# Altium schematic sheet DK_GU906_HW_V1.SchDoc
size A4
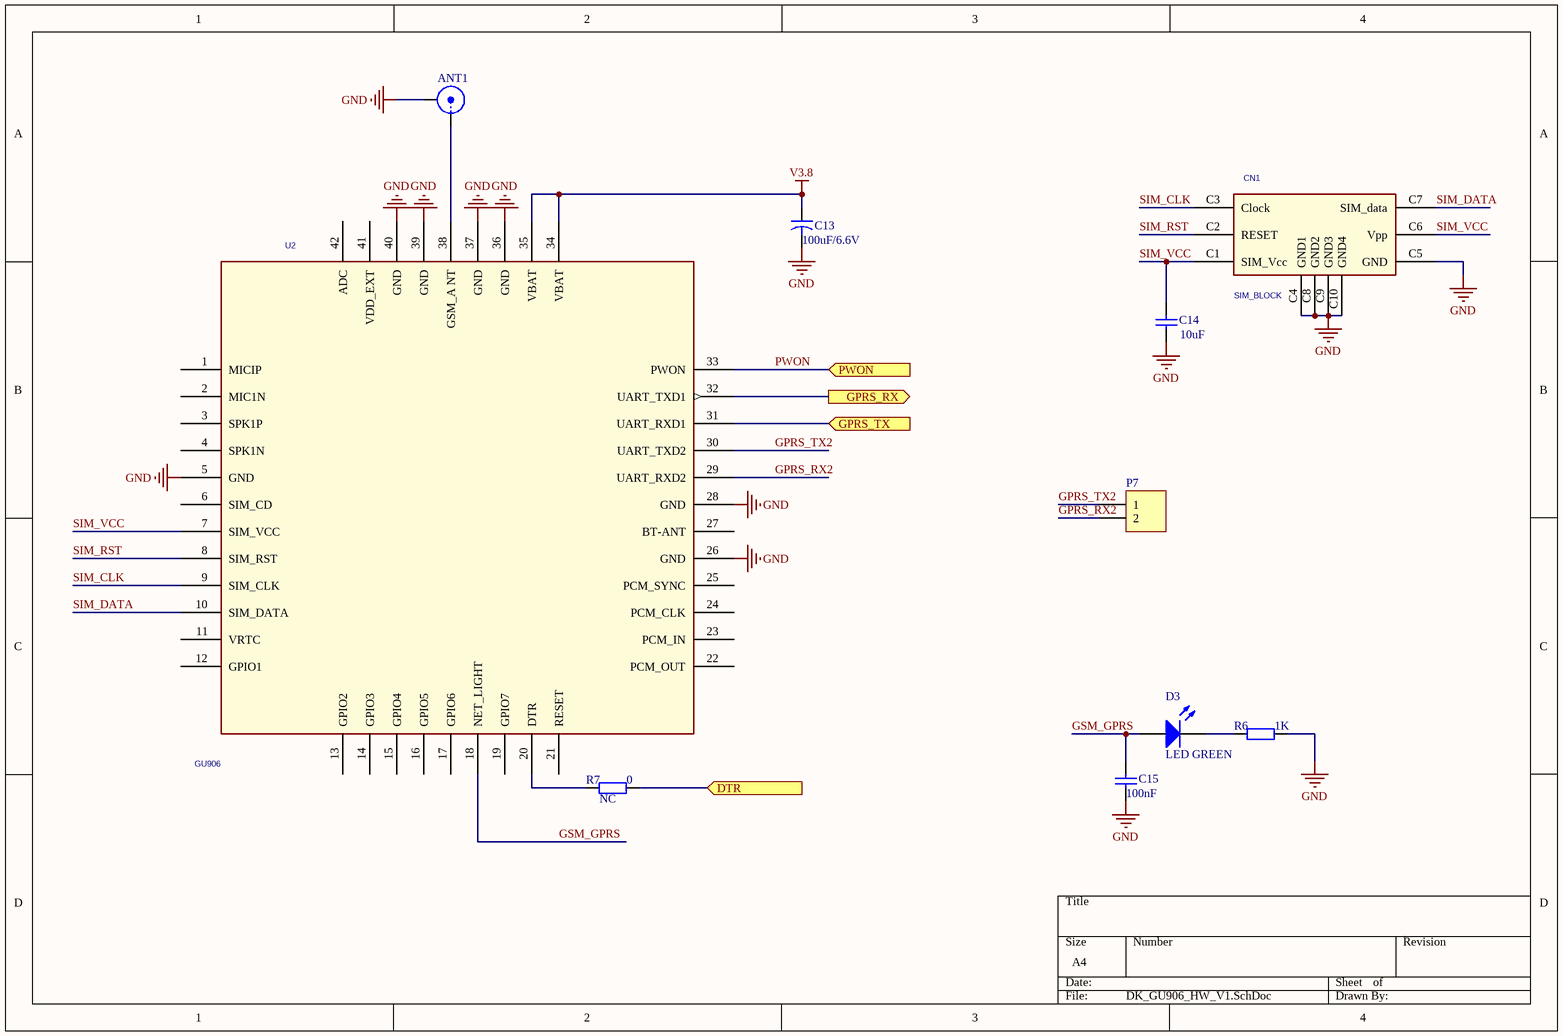
[diagram p0: DK_GU906_HW_V1.SchDoc]

## Parts
ANT1  SMB  [SMB_V-RJ45]  (value not drawn)
C13  value 100uF/6.6V  [0603]  (hidden comment: Cap2)
C14  value 10uF  [0603]  (hidden comment: Cap)
C15  value 100nF  [0603]  (hidden comment: Cap)
CN1  SIM_BLOCK  [SIM_BLOCK]
D3  LED GREEN  [LED0603]
P7  Header 2  [HDR1X2]  (value not drawn)
R6  value 1K  [0603]  (hidden comment: Res2)
R7  NC  value 0  [0603]
U2  GU906  [HFY_QFN_42_DTU]

## Ports
DTR (in), GPRS_RX (out), GPRS_TX (in), PWON (in)

## Nets
GND: ANT1.2(Y) C13.2 C14.1 C15.1 CN1.C4(GND1) CN1.C5(GND) CN1.C8(GND2) CN1.C9(GND3) CN1.C10(GND4) R6.2 U2.5(GND) U2.26(GND) U2.28(GND) U2.36(GND) U2.37(GND) U2.39(GND) U2.40(GND)
V3.8: C13.1 U2.34(VBAT) U2.35(VBAT)
DTR: R7.2 ; port DTR
GPRS_RX: U2.32(UART_TXD1) ; port GPRS_RX
GPRS_RX2: P7.2 U2.29(UART_RXD2)
GPRS_TX: U2.31(UART_RXD1) ; port GPRS_TX
GPRS_TX2: P7.1 U2.30(UART_TXD2)
GSM_GPRS: C15.2 D3.1(A) U2.18(NET_LIGHT)
PWON: U2.33(PWON) ; port PWON
SIM_CLK: CN1.C3(Clock) U2.9(SIM_CLK)
SIM_DATA: CN1.C7(SIM_data) U2.10(SIM_DATA)
SIM_RST: CN1.C2(RESET) U2.8(SIM_RST)
SIM_VCC: C14.2 CN1.C1(SIM_Vcc) CN1.C6(Vpp) U2.7(SIM_VCC)
NetANT1_1: ANT1.1(X) U2.38(GSM_A_NT)
NetD3_2: D3.2(K) R6.1
NetR7_1: R7.1 U2.20(DTR)

Not connected (* = marked no-connect by the designer): U2 1(MICIP) 2(MIC1N) 3(SPK1P) 4(SPK1N) 6(SIM_CD) 11(VRTC) 12(GPIO1) 13(GPIO2) 14(GPIO3) 15(GPIO4) 16(GPIO5) 17(GPIO6) 19(GPIO7) 21(RESET) 22(PCM_OUT) 23(PCM_IN) 24(PCM_CLK) 25(PCM_SYNC) 27(BT-ANT) 41(VDD_EXT) 42(ADC)

## Library data of the parts
ANT1 = SMB: SMB Straight Connector; LatestRevisionDate: 17-Jul-2002; LatestRevisionNote: Re-released for DXP Platform.; Publisher: Altium Limited
C13 = Cap2: Capacitor; Published: 23-Sep-2002; PackageReference: CAPR5-4X5; Publisher: Altium Limited; PackageDescription: Capacitor; 2 Leads
C14 C15 = Cap: Capacitor; Published: 8-Jun-2000; LatestRevisionDate: 17-Jul-2002; LatestRevisionNote: Re-released for DXP Platform.; PackageReference: RAD-0.3; Publisher: Altium Limited; PackageDescription: Radial Cap, Thru-Hole; 2 Leads; 0.3 in Pin Spacing
CN1 = SIM_BLOCK_2
D3 = LED2: Typical RED, GREEN, YELLOW, AMBER GaAs LED; Published: 8-Jun-2000; LatestRevisionDate: 17-Jul-2002; LatestRevisionNote: Re-released for DXP Platform.; PackageVersion: Feb-2002; PackageReference: 3.2X1.6X1.1; Publisher: Altium Limited; PackageDescription: SM LED; 2 Flat Leads
P7 = Header 2: Header, 2-Pin; LatestRevisionDate: 17-Jul-2002; LatestRevisionNote: Re-released for DXP Platform.; Publisher: Altium Limited
R6 R7 = Res2: Resistor; Published: 8-Jun-2000; LatestRevisionDate: 17-Jul-2002; LatestRevisionNote: Re-released for DXP Platform.; PackageReference: AXIAL-0.4; Publisher: Altium Limited; PackageDescription: Axial Device, Thru-Hole; 2 Leads; 0.4 in Pin Spacing
U2 = GU600_LIB_2